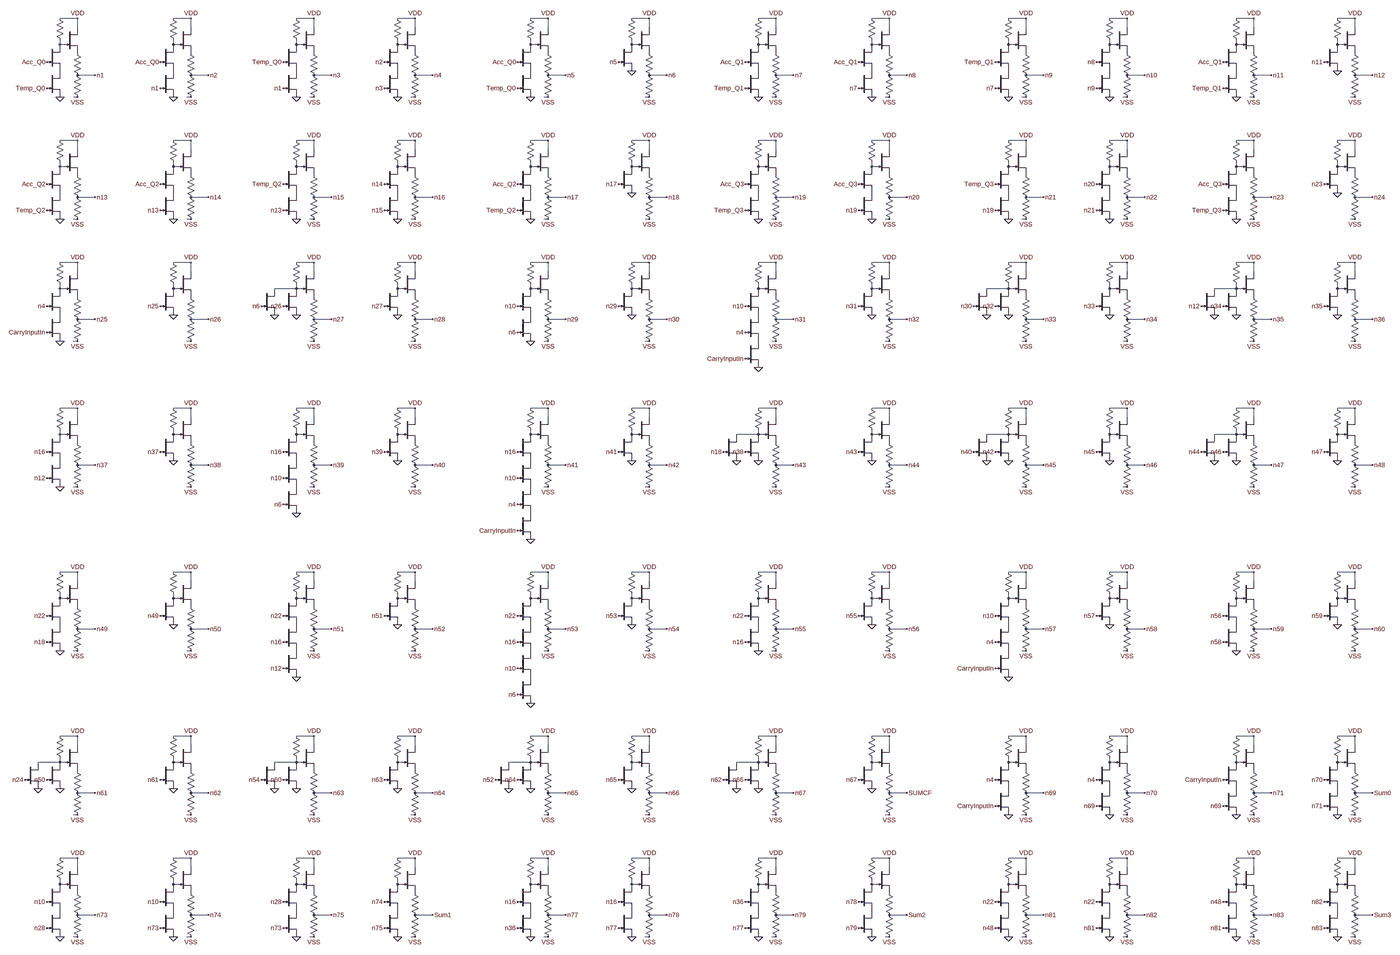
[diagram p0: schematic alu_adder_4bit.asc, whole sheet]
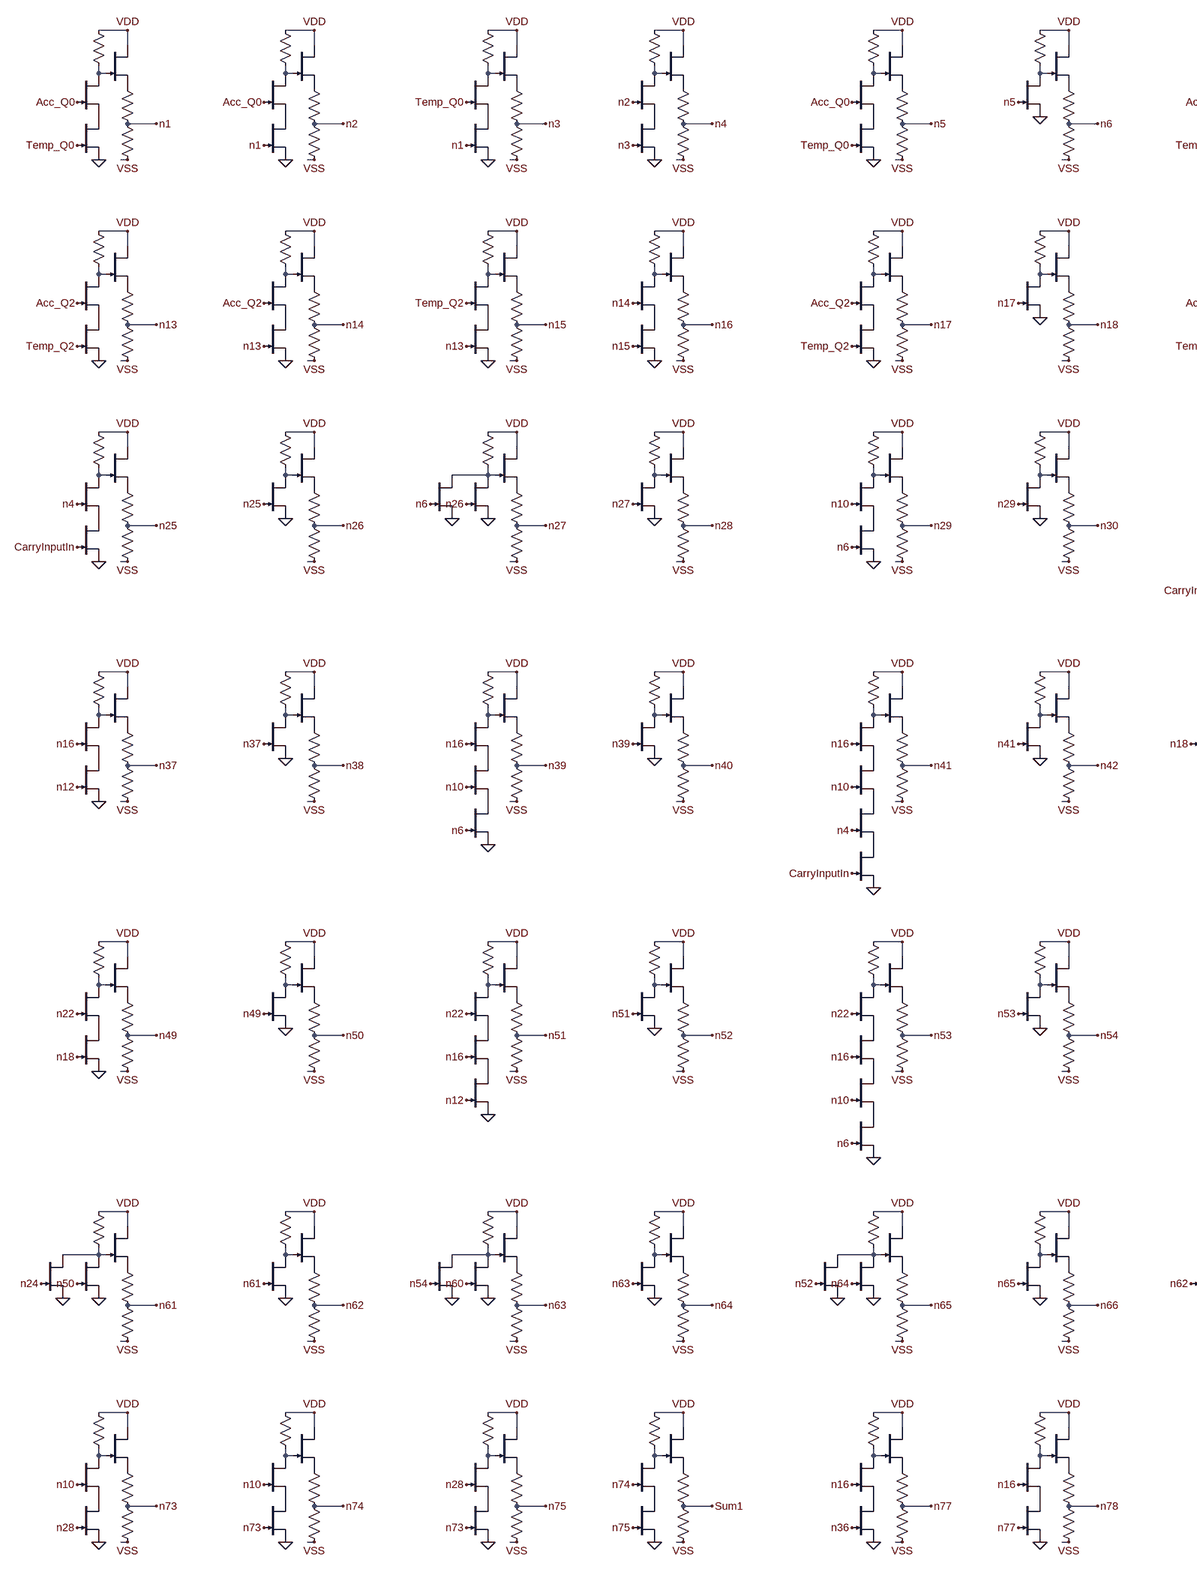
[diagram p1: schematic alu_adder_4bit.asc, part, row 1 of 1, column 1 of 2]
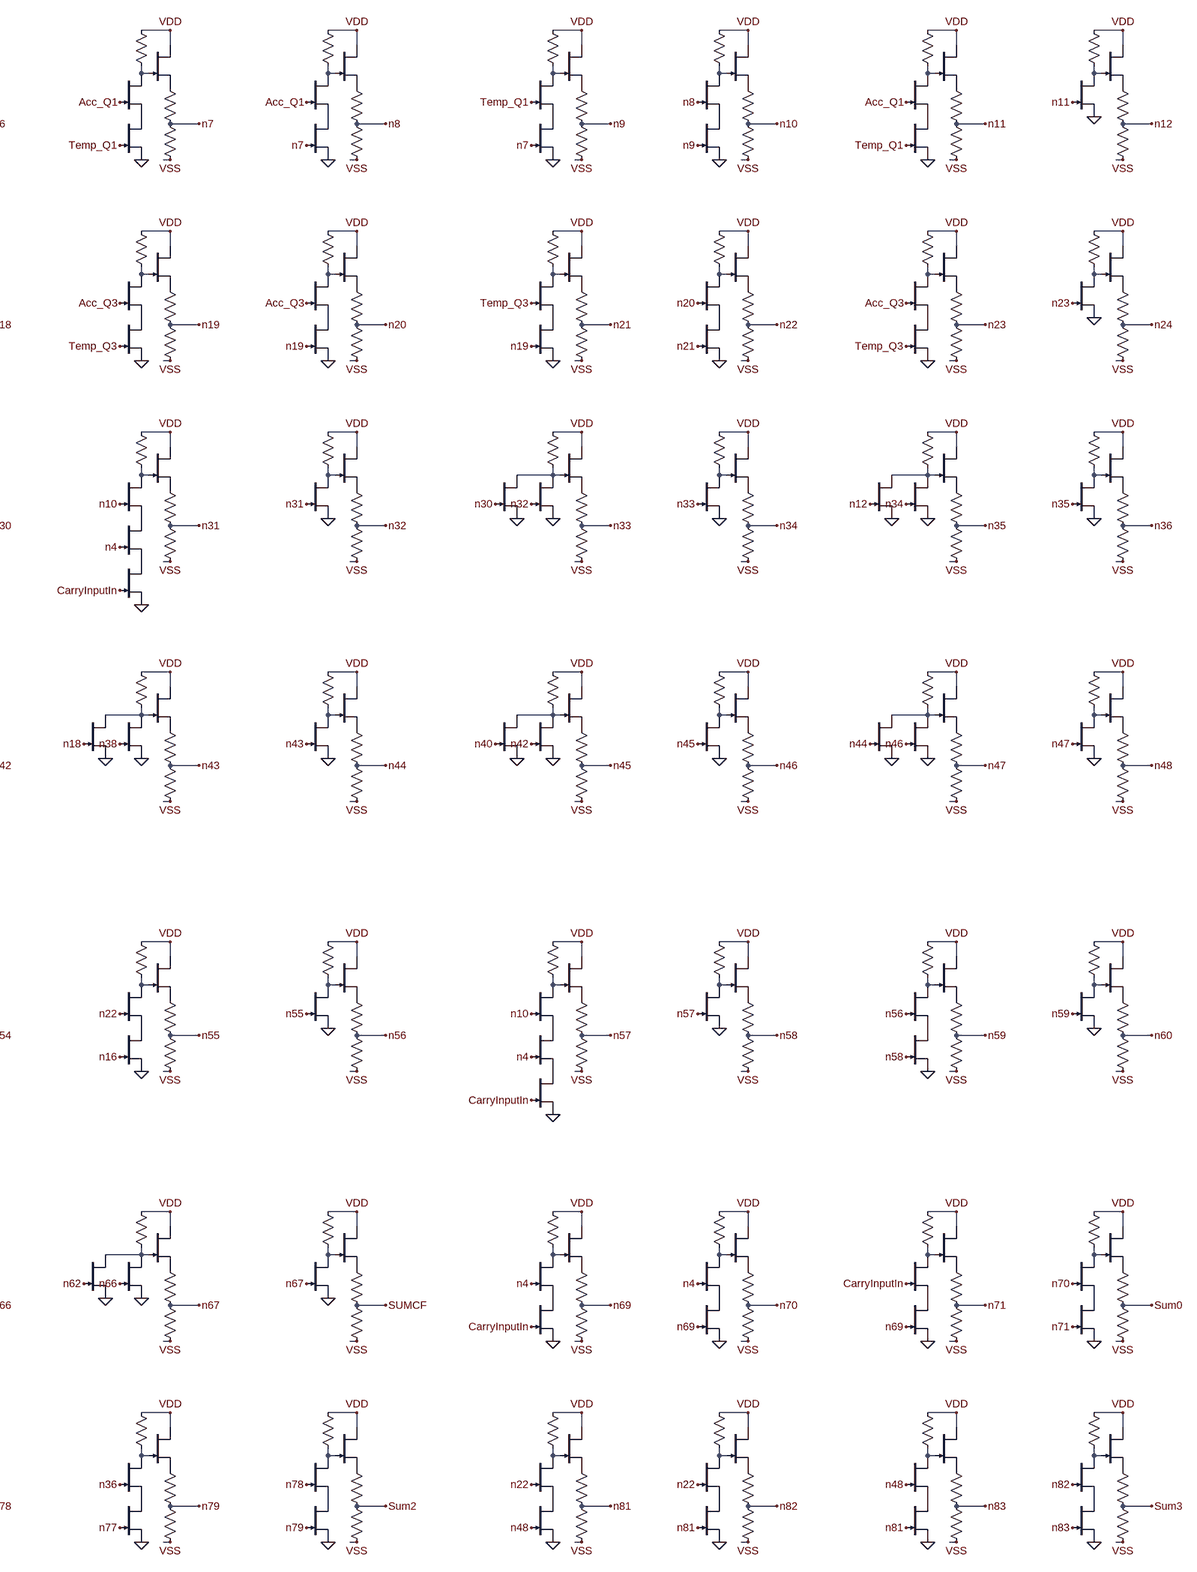
[diagram p2: schematic alu_adder_4bit.asc, part, row 1 of 1, column 2 of 2]
* alu_adder_4bit.asc
R1 VDD N001 100k
J_F1 VDD N001 P001 DR
R2 P001 n1 1k
R3 n1 VSS 4.8k
J_B1 N001 Acc_Q0 P002 DR
J_A1 P002 Temp_Q0 0 DR
R4 VDD N002 100k
J_F2 VDD N002 P003 DR
R5 P003 n2 1k
R6 n2 VSS 4.8k
J_B2 N002 Acc_Q0 P004 DR
J_A2 P004 n1 0 DR
R7 VDD N003 100k
J_F3 VDD N003 P005 DR
R8 P005 n3 1k
R9 n3 VSS 4.8k
J_B3 N003 Temp_Q0 P006 DR
J_A3 P006 n1 0 DR
R10 VDD N004 100k
J_F4 VDD N004 P007 DR
R11 P007 n4 1k
R12 n4 VSS 4.8k
J_B4 N004 n2 P008 DR
J_A4 P008 n3 0 DR
R13 VDD N005 100k
J_F5 VDD N005 P009 DR
R14 P009 n5 1k
R15 n5 VSS 4.8k
J_B5 N005 Acc_Q0 P010 DR
J_A5 P010 Temp_Q0 0 DR
R16 VDD N006 100k
J_F6 VDD N006 P011 DR
R17 P011 n6 1k
R18 n6 VSS 4.8k
J_B6 N006 n5 0 DR
R19 VDD N007 100k
J_F7 VDD N007 P012 DR
R20 P012 n7 1k
R21 n7 VSS 4.8k
J_B7 N007 Acc_Q1 P013 DR
J_A6 P013 Temp_Q1 0 DR
R22 VDD N008 100k
J_F8 VDD N008 P014 DR
R23 P014 n8 1k
R24 n8 VSS 4.8k
J_B8 N008 Acc_Q1 P015 DR
J_A7 P015 n7 0 DR
R25 VDD N009 100k
J_F9 VDD N009 P016 DR
R26 P016 n9 1k
R27 n9 VSS 4.8k
J_B9 N009 Temp_Q1 P017 DR
J_A8 P017 n7 0 DR
R28 VDD N010 100k
J_F10 VDD N010 P018 DR
R29 P018 n10 1k
R30 n10 VSS 4.8k
J_B10 N010 n8 P019 DR
J_A9 P019 n9 0 DR
R31 VDD N011 100k
J_F11 VDD N011 P020 DR
R32 P020 n11 1k
R33 n11 VSS 4.8k
J_B11 N011 Acc_Q1 P021 DR
J_A10 P021 Temp_Q1 0 DR
R34 VDD N012 100k
J_F12 VDD N012 P022 DR
R35 P022 n12 1k
R36 n12 VSS 4.8k
J_B12 N012 n11 0 DR
R37 VDD N013 100k
J_F13 VDD N013 P023 DR
R38 P023 n13 1k
R39 n13 VSS 4.8k
J_B13 N013 Acc_Q2 P024 DR
J_A11 P024 Temp_Q2 0 DR
R40 VDD N014 100k
J_F14 VDD N014 P025 DR
R41 P025 n14 1k
R42 n14 VSS 4.8k
J_B14 N014 Acc_Q2 P026 DR
J_A12 P026 n13 0 DR
R43 VDD N015 100k
J_F15 VDD N015 P027 DR
R44 P027 n15 1k
R45 n15 VSS 4.8k
J_B15 N015 Temp_Q2 P028 DR
J_A13 P028 n13 0 DR
R46 VDD N016 100k
J_F16 VDD N016 P029 DR
R47 P029 n16 1k
R48 n16 VSS 4.8k
J_B16 N016 n14 P030 DR
J_A14 P030 n15 0 DR
R49 VDD N017 100k
J_F17 VDD N017 P031 DR
R50 P031 n17 1k
R51 n17 VSS 4.8k
J_B17 N017 Acc_Q2 P032 DR
J_A15 P032 Temp_Q2 0 DR
R52 VDD N018 100k
J_F18 VDD N018 P033 DR
R53 P033 n18 1k
R54 n18 VSS 4.8k
J_B18 N018 n17 0 DR
R55 VDD N019 100k
J_F19 VDD N019 P034 DR
R56 P034 n19 1k
R57 n19 VSS 4.8k
J_B19 N019 Acc_Q3 P035 DR
J_A16 P035 Temp_Q3 0 DR
R58 VDD N020 100k
J_F20 VDD N020 P036 DR
R59 P036 n20 1k
R60 n20 VSS 4.8k
J_B20 N020 Acc_Q3 P037 DR
J_A17 P037 n19 0 DR
R61 VDD N021 100k
J_F21 VDD N021 P038 DR
R62 P038 n21 1k
R63 n21 VSS 4.8k
J_B21 N021 Temp_Q3 P039 DR
J_A18 P039 n19 0 DR
R64 VDD N022 100k
J_F22 VDD N022 P040 DR
R65 P040 n22 1k
R66 n22 VSS 4.8k
J_B22 N022 n20 P041 DR
J_A19 P041 n21 0 DR
R67 VDD N023 100k
J_F23 VDD N023 P042 DR
R68 P042 n23 1k
R69 n23 VSS 4.8k
J_B23 N023 Acc_Q3 P043 DR
J_A20 P043 Temp_Q3 0 DR
R70 VDD N024 100k
J_F24 VDD N024 P044 DR
R71 P044 n24 1k
R72 n24 VSS 4.8k
J_B24 N024 n23 0 DR
R73 VDD N025 100k
J_F25 VDD N025 P045 DR
R74 P045 n25 1k
R75 n25 VSS 4.8k
J_B25 N025 n4 P046 DR
J_A21 P046 CarryInputIn 0 DR
R76 VDD N026 100k
J_F26 VDD N026 P047 DR
R77 P047 n26 1k
R78 n26 VSS 4.8k
J_B26 N026 n25 0 DR
R79 VDD N027 100k
J_F27 VDD N027 P048 DR
R80 P048 n27 1k
R81 n27 VSS 4.8k
J_B27 N027 n26 0 DR
J_B28 N027 n6 0 DR
R82 VDD N028 100k
J_F28 VDD N028 P049 DR
R83 P049 n28 1k
R84 n28 VSS 4.8k
J_B29 N028 n27 0 DR
R85 VDD N029 100k
J_F29 VDD N029 P050 DR
R86 P050 n29 1k
R87 n29 VSS 4.8k
J_B30 N029 n10 P051 DR
J_A22 P051 n6 0 DR
R88 VDD N030 100k
J_F30 VDD N030 P052 DR
R89 P052 n30 1k
R90 n30 VSS 4.8k
J_B31 N030 n29 0 DR
R91 VDD N031 100k
J_F31 VDD N031 P053 DR
R92 P053 n31 1k
R93 n31 VSS 4.8k
J_B32 N031 n10 P054 DR
J_A23 P054 n4 P055 DR
J_A24 P055 CarryInputIn 0 DR
R94 VDD N032 100k
J_F32 VDD N032 P056 DR
R95 P056 n32 1k
R96 n32 VSS 4.8k
J_B33 N032 n31 0 DR
R97 VDD N033 100k
J_F33 VDD N033 P057 DR
R98 P057 n33 1k
R99 n33 VSS 4.8k
J_B34 N033 n32 0 DR
J_B35 N033 n30 0 DR
R100 VDD N034 100k
J_F34 VDD N034 P058 DR
R101 P058 n34 1k
R102 n34 VSS 4.8k
J_B36 N034 n33 0 DR
R103 VDD N035 100k
J_F35 VDD N035 P059 DR
R104 P059 n35 1k
R105 n35 VSS 4.8k
J_B37 N035 n34 0 DR
J_B38 N035 n12 0 DR
R106 VDD N036 100k
J_F36 VDD N036 P060 DR
R107 P060 n36 1k
R108 n36 VSS 4.8k
J_B39 N036 n35 0 DR
R109 VDD N037 100k
J_F37 VDD N037 P061 DR
R110 P061 n37 1k
R111 n37 VSS 4.8k
J_B40 N037 n16 P062 DR
J_A25 P062 n12 0 DR
R112 VDD N038 100k
J_F38 VDD N038 P063 DR
R113 P063 n38 1k
R114 n38 VSS 4.8k
J_B41 N038 n37 0 DR
R115 VDD N039 100k
J_F39 VDD N039 P064 DR
R116 P064 n39 1k
R117 n39 VSS 4.8k
J_B42 N039 n16 P065 DR
J_A26 P065 n10 P066 DR
J_A27 P066 n6 0 DR
R118 VDD N040 100k
J_F40 VDD N040 P067 DR
R119 P067 n40 1k
R120 n40 VSS 4.8k
J_B43 N040 n39 0 DR
R121 VDD N041 100k
J_F41 VDD N041 P068 DR
R122 P068 n41 1k
R123 n41 VSS 4.8k
J_B44 N041 n16 P069 DR
J_A28 P069 n10 P070 DR
J_A29 P070 n4 P071 DR
J_A30 P071 CarryInputIn 0 DR
R124 VDD N042 100k
J_F42 VDD N042 P072 DR
R125 P072 n42 1k
R126 n42 VSS 4.8k
J_B45 N042 n41 0 DR
R127 VDD N043 100k
J_F43 VDD N043 P073 DR
R128 P073 n43 1k
R129 n43 VSS 4.8k
J_B46 N043 n38 0 DR
J_B47 N043 n18 0 DR
R130 VDD N044 100k
J_F44 VDD N044 P074 DR
R131 P074 n44 1k
R132 n44 VSS 4.8k
J_B48 N044 n43 0 DR
R133 VDD N045 100k
J_F45 VDD N045 P075 DR
R134 P075 n45 1k
R135 n45 VSS 4.8k
J_B49 N045 n42 0 DR
J_B50 N045 n40 0 DR
R136 VDD N046 100k
J_F46 VDD N046 P076 DR
R137 P076 n46 1k
R138 n46 VSS 4.8k
J_B51 N046 n45 0 DR
R139 VDD N047 100k
J_F47 VDD N047 P077 DR
R140 P077 n47 1k
R141 n47 VSS 4.8k
J_B52 N047 n46 0 DR
J_B53 N047 n44 0 DR
R142 VDD N048 100k
J_F48 VDD N048 P078 DR
R143 P078 n48 1k
R144 n48 VSS 4.8k
J_B54 N048 n47 0 DR
R145 VDD N049 100k
J_F49 VDD N049 P079 DR
R146 P079 n49 1k
R147 n49 VSS 4.8k
J_B55 N049 n22 P080 DR
J_A31 P080 n18 0 DR
R148 VDD N050 100k
J_F50 VDD N050 P081 DR
R149 P081 n50 1k
R150 n50 VSS 4.8k
J_B56 N050 n49 0 DR
R151 VDD N051 100k
J_F51 VDD N051 P082 DR
R152 P082 n51 1k
R153 n51 VSS 4.8k
J_B57 N051 n22 P083 DR
J_A32 P083 n16 P084 DR
J_A33 P084 n12 0 DR
R154 VDD N052 100k
J_F52 VDD N052 P085 DR
R155 P085 n52 1k
R156 n52 VSS 4.8k
J_B58 N052 n51 0 DR
R157 VDD N053 100k
J_F53 VDD N053 P086 DR
R158 P086 n53 1k
R159 n53 VSS 4.8k
J_B59 N053 n22 P087 DR
J_A34 P087 n16 P088 DR
J_A35 P088 n10 P089 DR
J_A36 P089 n6 0 DR
R160 VDD N054 100k
J_F54 VDD N054 P090 DR
R161 P090 n54 1k
R162 n54 VSS 4.8k
J_B60 N054 n53 0 DR
R163 VDD N055 100k
J_F55 VDD N055 P091 DR
R164 P091 n55 1k
R165 n55 VSS 4.8k
J_B61 N055 n22 P092 DR
J_A37 P092 n16 0 DR
R166 VDD N056 100k
J_F56 VDD N056 P093 DR
R167 P093 n56 1k
R168 n56 VSS 4.8k
J_B62 N056 n55 0 DR
R169 VDD N057 100k
J_F57 VDD N057 P094 DR
R170 P094 n57 1k
R171 n57 VSS 4.8k
J_B63 N057 n10 P095 DR
J_A38 P095 n4 P096 DR
J_A39 P096 CarryInputIn 0 DR
R172 VDD N058 100k
J_F58 VDD N058 P097 DR
R173 P097 n58 1k
R174 n58 VSS 4.8k
J_B64 N058 n57 0 DR
R175 VDD N059 100k
J_F59 VDD N059 P098 DR
R176 P098 n59 1k
R177 n59 VSS 4.8k
J_B65 N059 n56 P099 DR
J_A40 P099 n58 0 DR
R178 VDD N060 100k
J_F60 VDD N060 P100 DR
R179 P100 n60 1k
R180 n60 VSS 4.8k
J_B66 N060 n59 0 DR
R181 VDD N061 100k
J_F61 VDD N061 P101 DR
R182 P101 n61 1k
R183 n61 VSS 4.8k
J_B67 N061 n50 0 DR
J_B68 N061 n24 0 DR
R184 VDD N062 100k
J_F62 VDD N062 P102 DR
R185 P102 n62 1k
R186 n62 VSS 4.8k
J_B69 N062 n61 0 DR
R187 VDD N063 100k
J_F63 VDD N063 P103 DR
R188 P103 n63 1k
R189 n63 VSS 4.8k
J_B70 N063 n60 0 DR
J_B71 N063 n54 0 DR
R190 VDD N064 100k
J_F64 VDD N064 P104 DR
R191 P104 n64 1k
R192 n64 VSS 4.8k
J_B72 N064 n63 0 DR
R193 VDD N065 100k
J_F65 VDD N065 P105 DR
R194 P105 n65 1k
R195 n65 VSS 4.8k
J_B73 N065 n64 0 DR
J_B74 N065 n52 0 DR
R196 VDD N066 100k
J_F66 VDD N066 P106 DR
R197 P106 n66 1k
R198 n66 VSS 4.8k
J_B75 N066 n65 0 DR
R199 VDD N067 100k
J_F67 VDD N067 P107 DR
R200 P107 n67 1k
R201 n67 VSS 4.8k
J_B76 N067 n66 0 DR
J_B77 N067 n62 0 DR
R202 VDD N068 100k
J_F68 VDD N068 P108 DR
R203 P108 SUMCF 1k
R204 SUMCF VSS 4.8k
J_B78 N068 n67 0 DR
R205 VDD N069 100k
J_F69 VDD N069 P109 DR
R206 P109 n69 1k
R207 n69 VSS 4.8k
J_B79 N069 n4 P110 DR
J_A41 P110 CarryInputIn 0 DR
R208 VDD N070 100k
J_F70 VDD N070 P111 DR
R209 P111 n70 1k
R210 n70 VSS 4.8k
J_B80 N070 n4 P112 DR
J_A42 P112 n69 0 DR
R211 VDD N071 100k
J_F71 VDD N071 P113 DR
R212 P113 n71 1k
R213 n71 VSS 4.8k
J_B81 N071 CarryInputIn P114 DR
J_A43 P114 n69 0 DR
R214 VDD N072 100k
J_F72 VDD N072 P115 DR
R215 P115 Sum0 1k
R216 Sum0 VSS 4.8k
J_B82 N072 n70 P116 DR
J_A44 P116 n71 0 DR
R217 VDD N073 100k
J_F73 VDD N073 P117 DR
R218 P117 n73 1k
R219 n73 VSS 4.8k
J_B83 N073 n10 P118 DR
J_A45 P118 n28 0 DR
R220 VDD N074 100k
J_F74 VDD N074 P119 DR
R221 P119 n74 1k
R222 n74 VSS 4.8k
J_B84 N074 n10 P120 DR
J_A46 P120 n73 0 DR
R223 VDD N075 100k
J_F75 VDD N075 P121 DR
R224 P121 n75 1k
R225 n75 VSS 4.8k
J_B85 N075 n28 P122 DR
J_A47 P122 n73 0 DR
R226 VDD N076 100k
J_F76 VDD N076 P123 DR
R227 P123 Sum1 1k
R228 Sum1 VSS 4.8k
J_B86 N076 n74 P124 DR
J_A48 P124 n75 0 DR
R229 VDD N077 100k
J_F77 VDD N077 P125 DR
R230 P125 n77 1k
R231 n77 VSS 4.8k
J_B87 N077 n16 P126 DR
J_A49 P126 n36 0 DR
R232 VDD N078 100k
J_F78 VDD N078 P127 DR
R233 P127 n78 1k
R234 n78 VSS 4.8k
J_B88 N078 n16 P128 DR
J_A50 P128 n77 0 DR
R235 VDD N079 100k
J_F79 VDD N079 P129 DR
R236 P129 n79 1k
R237 n79 VSS 4.8k
J_B89 N079 n36 P130 DR
J_A51 P130 n77 0 DR
R238 VDD N080 100k
J_F80 VDD N080 P131 DR
R239 P131 Sum2 1k
R240 Sum2 VSS 4.8k
J_B90 N080 n78 P132 DR
J_A52 P132 n79 0 DR
R241 VDD N081 100k
J_F81 VDD N081 P133 DR
R242 P133 n81 1k
R243 n81 VSS 4.8k
J_B91 N081 n22 P134 DR
J_A53 P134 n48 0 DR
R244 VDD N082 100k
J_F82 VDD N082 P135 DR
R245 P135 n82 1k
R246 n82 VSS 4.8k
J_B92 N082 n22 P136 DR
J_A54 P136 n81 0 DR
R247 VDD N083 100k
J_F83 VDD N083 P137 DR
R248 P137 n83 1k
R249 n83 VSS 4.8k
J_B93 N083 n48 P138 DR
J_A55 P138 n81 0 DR
R250 VDD N084 100k
J_F84 VDD N084 P139 DR
R251 P139 Sum3 1k
R252 Sum3 VSS 4.8k
J_B94 N084 n82 P140 DR
J_A56 P140 n83 0 DR
.model NJF NJF
.model PJF PJF
.lib standard.jft
.backanno
.end